# EAGLE design heehaw10 (EAGLE 9.6.2)
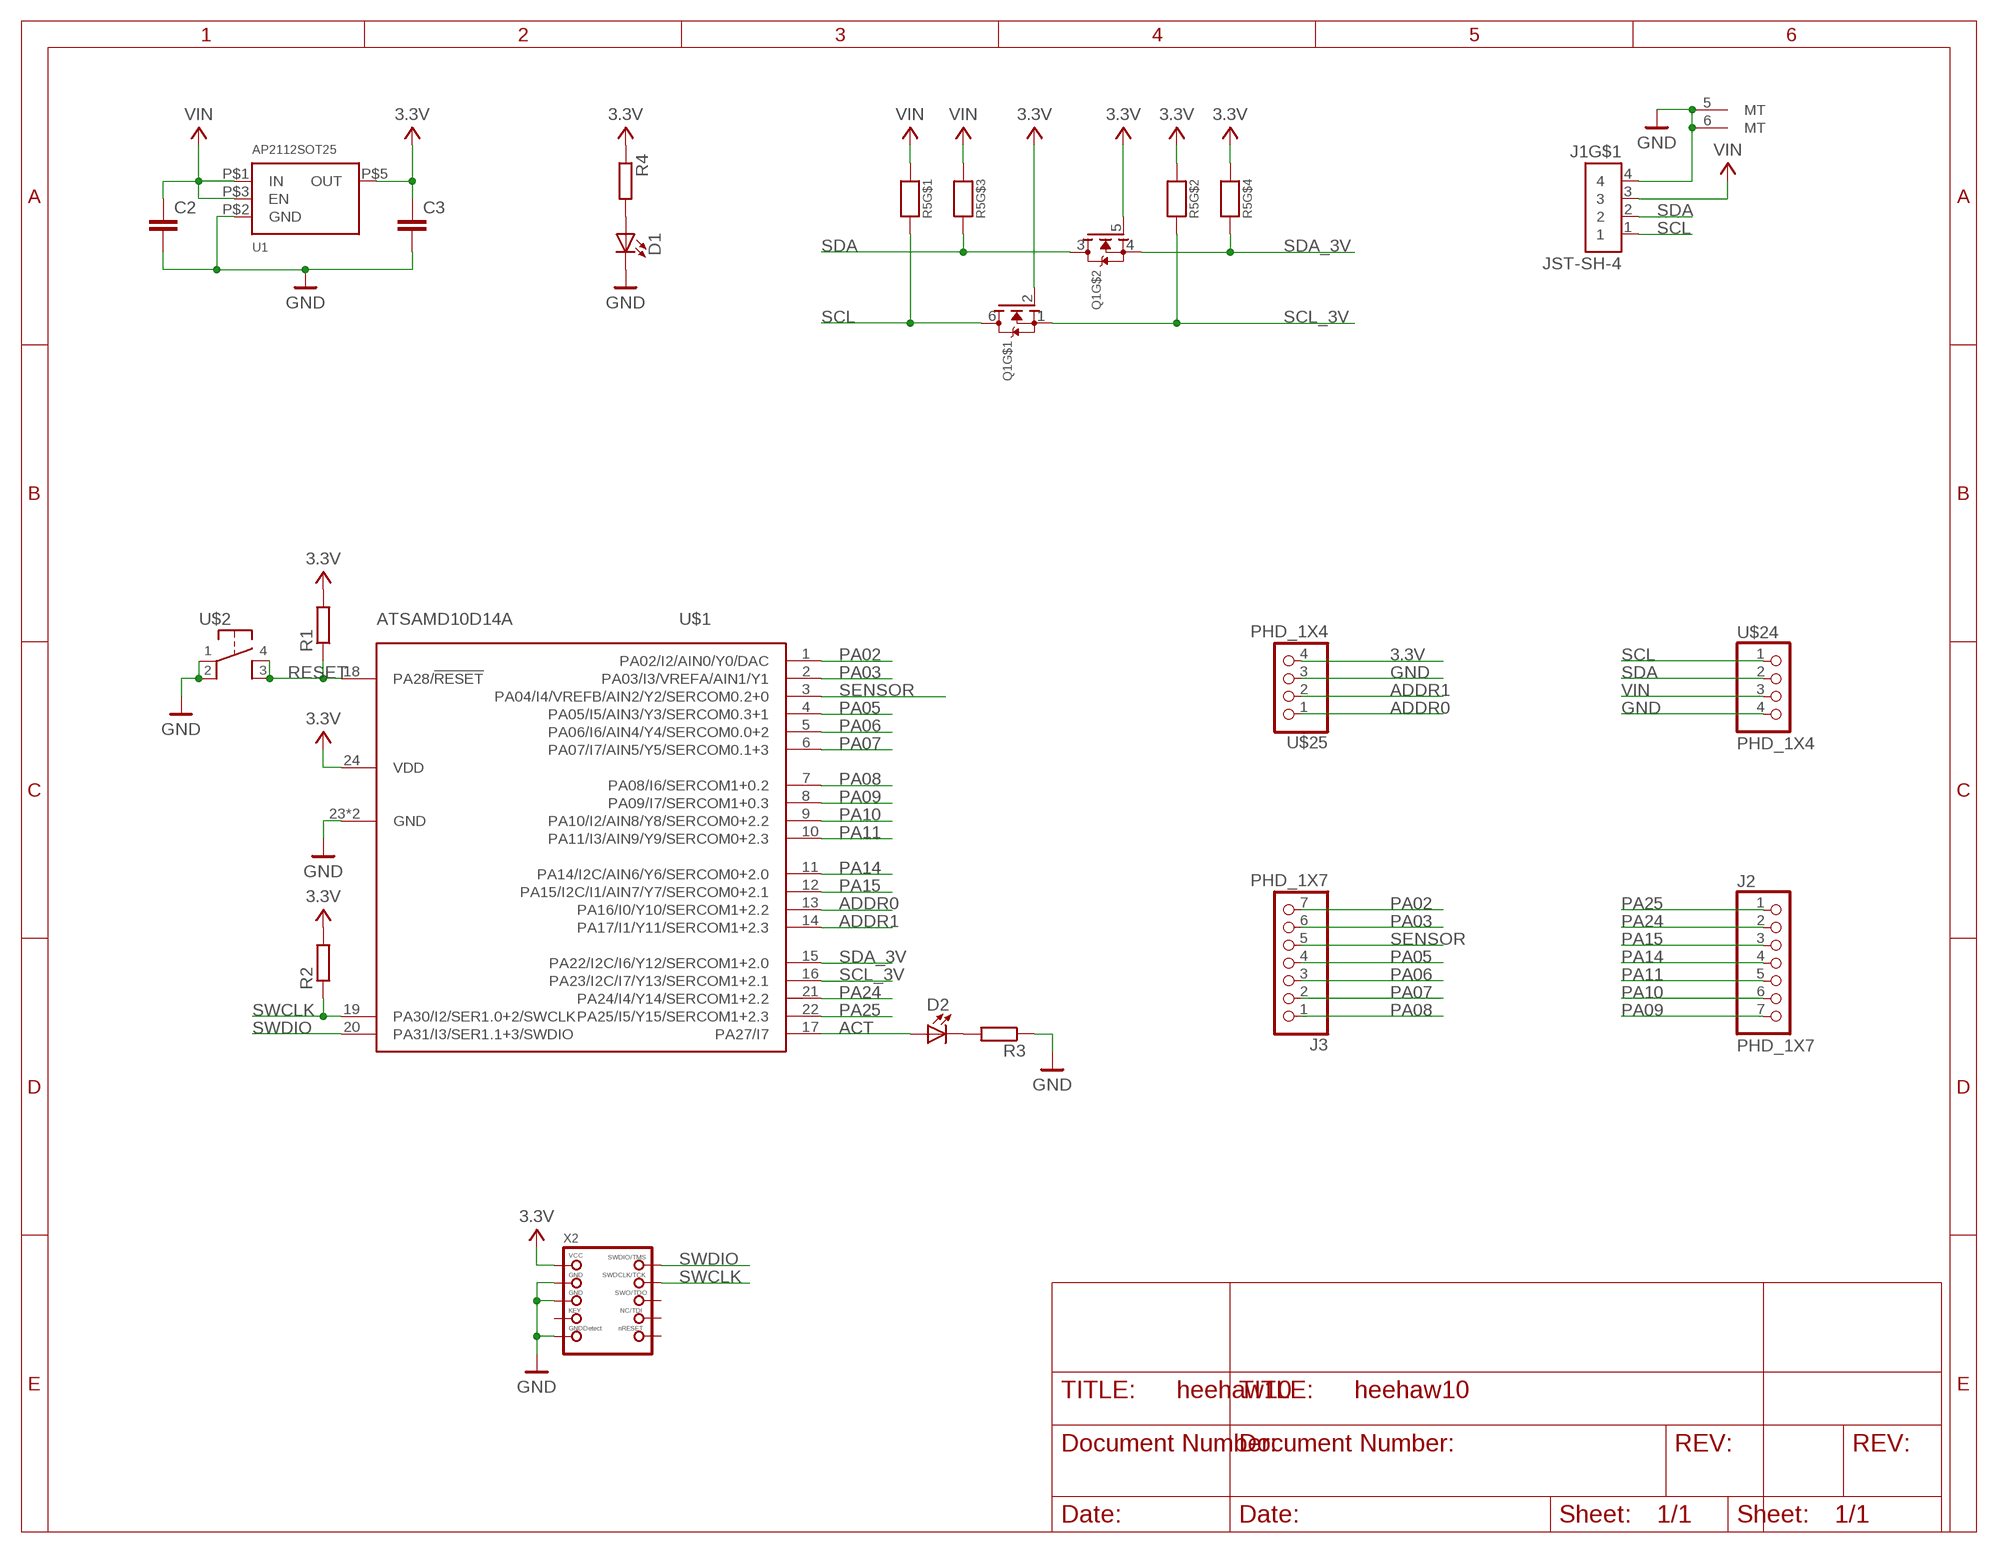
[diagram p0: schematic, sheet 1]

## Parts
C2  C-EUC0603  [C0603]
C3  C-EUC0603  [C0603]
D1  SMD_LED0603  [LED0603]
D2  SMD_LED0603  [LED0603]
J1  JST-SH-4  [JST-S4B-SH-SM4-TB]
J2  PHD_1X7  [PHD_1X7]
J3  PHD_1X7  [PHD_1X7]
Q1  MOSFET-N_DUAL  [SOT363]
R1  R-EU_R0603  [R0603]
R2  R-EU_R0603  [R0603]
R3  R-EU_R0603  [R0603]
R4  R-EU_R0603  [R0603]
R5  RESISTOR_4PACK  [RESPACK_4X0603]
U1  AP2112SOT25  [SOT25]
U$1  ATSAMD10D14A  [QFN24_4MM]
U$2  PTS647  [PTS647]
U$24  PHD_1X4  [PHD_1X4]
U$25  PHD_1X4  [PHD_1X4]
X2  SWD_2X5  [SWD_MINI]

## Nets
3.3V: C3.1 Q1.2(G) Q1.5(G) R1.2 R2.2 R4.1 R5.2 R5.4 U1.P$5(OUT) U$1.24(VDD) U$25.4 X2.1(VCC)
ACT: D2.2(A) U$1.17(PA27/I7)
ADDR0: U$1.13(PA16/I0/Y10/SERCOM1+2.2) U$25.1
ADDR1: U$1.14(PA17/I1/Y11/SERCOM1+2.3) U$25.2
GND: C2.2 C3.2 D1.1(C) J1.4 J1.5(MT) J1.6(MT) R3.1 U1.P$2(GND) U$1.23(GND) U$1.THERM(GND) U$2.1 U$2.2 U$24.4 U$25.3 X2.3(GND) X2.5(GND) X2.9(GNDDETECT)
N$2: D1.2(A) R4.2
N$3: D2.1(C) R3.2
PA02: J3.7 U$1.1(PA02/I2/AIN0/Y0/DAC)
PA03: J3.6 U$1.2(PA03/I3/VREFA/AIN1/Y1)
PA05: J3.4 U$1.4(PA05/I5/AIN3/Y3/SERCOM0.3+1)
PA06: J3.3 U$1.5(PA06/I6/AIN4/Y4/SERCOM0.0+2)
PA07: J3.2 U$1.6(PA07/I7/AIN5/Y5/SERCOM0.1+3)
PA08: J3.1 U$1.7(PA08/I6/SERCOM1+0.2)
PA09: J2.7 U$1.8(PA09/I7/SERCOM1+0.3)
PA10: J2.6 U$1.9(PA10/I2/AIN8/Y8/SERCOM0+2.2)
PA11: J2.5 U$1.10(PA11/I3/AIN9/Y9/SERCOM0+2.3)
PA14: J2.4 U$1.11(PA14/I2C/AIN6/Y6/SERCOM0+2.0)
PA15: J2.3 U$1.12(PA15/I2C/I1/AIN7/Y7/SERCOM0+2.1)
PA24: J2.2 U$1.21(PA24/I4/Y14/SERCOM1+2.2)
PA25: J2.1 U$1.22(PA25/I5/Y15/SERCOM1+2.3)
RESET: R1.1 U$1.18(PA28/!RESET) U$2.3 U$2.4
SCL: J1.1 Q1.6(D) R5.8 U$24.1
SCL_3V: Q1.1(S) R5.7 U$1.16(PA23/I2C/I7/Y13/SERCOM1+2.1)
SDA: J1.2 Q1.3(D) R5.6 U$24.2
SDA_3V: Q1.4(S) R5.5 U$1.15(PA22/I2C/I6/Y12/SERCOM1+2.0)
SENSOR: J3.5 U$1.3(PA04/I4/VREFB/AIN2/Y2/SERCOM0.2+0)
SWCLK: R2.1 U$1.19(PA30/I2/SER1.0+2/SWCLK) X2.4(SWDCLK)
SWDIO: U$1.20(PA31/I3/SER1.1+3/SWDIO) X2.2(SWDIO)
VIN: C2.1 J1.3 R5.1 R5.3 U1.P$1(IN) U1.P$3(EN) U$24.3
Unconnected: X2.6(SWO) X2.7(KEY) X2.8(TDI) X2.10(NRESET)

## Library data of the parts
C2 C3 = rcl:C-EU: CAPACITOR, European symbol; SPICEPREFIX: C
D1 D2 = Ooo-LED:SMD_LED
J1 = Ooo-Connectors:JST-SH-4
J2 J3 = Ooo-Connectors:PHD_1X7
Q1 = Ooo-Transistors:MOSFET-N_DUAL: Dual N-Channel MOSFET SOT363 (2.0x1.25mm) 2N7002PS - 60V, 320mA [Digikey: 568-5984-1-ND]
R1-R4 = rcl:R-EU_: RESISTOR, European symbol; SPICEPREFIX: R
R5 = Ooo-Resistors:RESISTOR_4PACK: Resistor Packs (4 resistors) 4 x 0603 10K 1/16W - Digikey: YC164J-10KCT-ND
U1 = Ooo-IC-Power:AP2112
U$1 = Ooo-IC-Microcontroller:ATSAMD10D14A
U$2 = Ooo-Switches:PTS647: C&K PTS647 Tact Switch
U$24 U$25 = Ooo-Connectors:PHD_1X4
X2 = Ooo-Connectors:SWD_2X5: SWD Connector Standard 0.05" 10-pin connector.

## Board
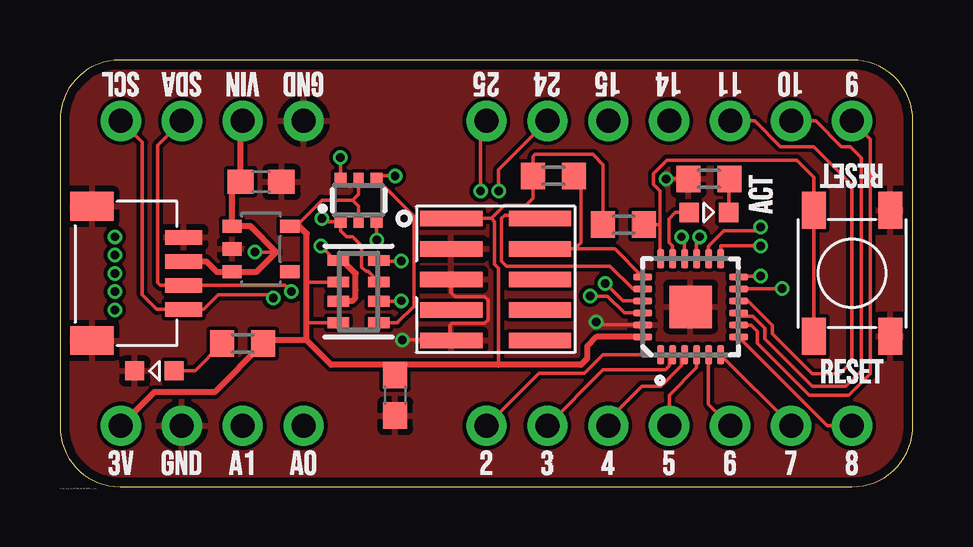
[diagram p1: board, top side]
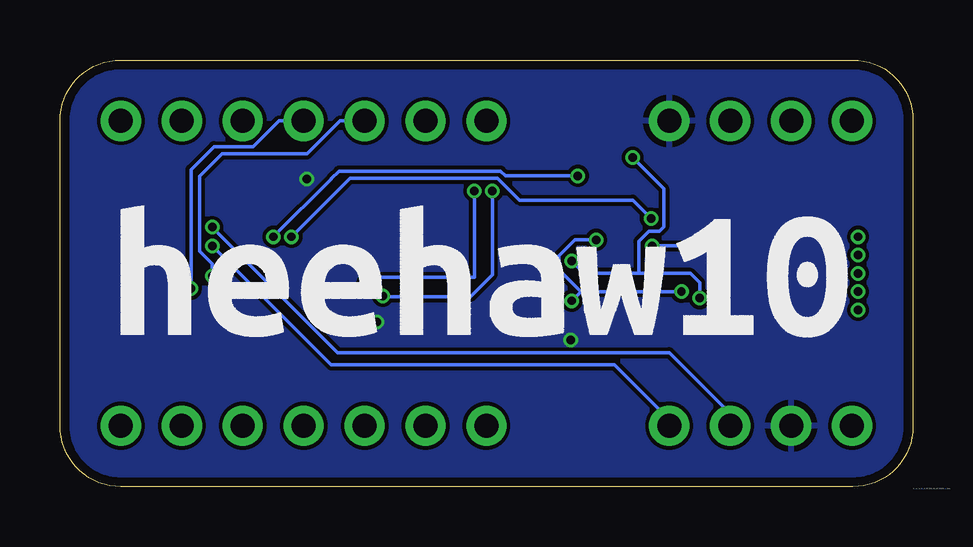
[diagram p2: board, bottom side, seen from below]

Size 35.56 x 17.78 mm. Coordinates in mm from the lower left corner, seen from the top.
Outline: 0,15.28 0,2.5 arc90 2.5,0 33.02,0 arc90 35.56,2.54 35.56,15.24 arc90 33.02,17.78 2.5,17.78 arc90 0,15.28
Copper layers (1*16): Top 0.035559375mm / dielectric 1.6mm / Bottom 0.035559375mm
Design rules "oshpark-2layer": minimum track width 6mil, minimum drill 10mil, track to track 6mil, track to pad 6mil, pad to pad 6mil, via to via 6mil, smd to smd 6mil, copper to edge 15mil, drill to drill 6mil, minimum pad ring 5mil, minimum via ring 5mil, stop-mask expansion 2.5mil, vias tented up to drill 0mil, thermal gap 10mil

### Footprints (pad centres in the part's own frame; a part is rotated, then mirrored left to right if it is on the bottom)
C0603 = smd 1.1 x 1: 1 -0.85,0; 2 0.85,0
LED0603 = smd 0.8 x 0.8: 1 -0.825,0; 2 0.825,0
JST-S4B-SH-SM4-TB = smd 1.55 x 0.6: 1 -4.525,1.5; 2 -4.525,0.5; 3 -4.525,-0.5; 4 -4.525,-1.5 | smd 1.8 x 1.2: 5 -0.7,2.8; 6 -0.7,-2.8
PHD_1X7 = drill 1 pad 1.676: 1 0,0; 2 2.54,0; 3 5.08,0; 4 7.62,0; 5 10.16,0; 6 12.7,0; 7 15.24,0
SOT363 = smd 0.5 x 0.5: 1 -0.75,-0.9; 3 0.75,-0.9; 4 0.75,0.9; 6 -0.75,0.9 | smd 0.4 x 0.5: 2 0,-0.9; 5 0,0.9
R0603 = smd 1 x 1.1: 1 -0.85,0; 2 0.85,0
RESPACK_4X0603 = smd 0.45 x 0.9: 1 -1.3,-0.85; 2 -0.4,-0.85; 3 0.4,-0.85; 4 1.3,-0.85; 5 1.3,0.85; 6 0.4,0.85; 7 -0.4,0.85; 8 -1.3,0.85
SOT25 = smd 0.55 x 0.8: P$1 0.95,1.2; P$2 0,1.2; P$3 -0.95,1.2; P$4 -0.95,-1.2; P$5 0.95,-1.2
QFN24_4MM = smd 0.8 x 0.28: 1 -2,1.25; 2 -2,0.75; 3 -2,0.25; 4 -2,-0.25; 5 -2,-0.75; 6 -2,-1.25; 13 2,-1.25; 14 2,-0.75; 15 2,-0.25; 16 2,0.25; 17 2,0.75; 18 2,1.25 | smd 0.28 x 0.8: 7 -1.25,-2; 8 -0.75,-2; 9 -0.25,-2; 10 0.25,-2; 11 0.75,-2; 12 1.25,-2; 19 1.25,2; 20 0.75,2; 21 0.25,2; 22 -0.25,2; 23 -0.75,2; 24 -1.25,2 | smd 1.778 x 1.778: THERM 0,0
PTS647 = smd 1.55 x 1: 1 -2.625,1.6; 2 2.625,1.6; 3 -2.625,-1.6; 4 2.625,-1.6
PHD_1X4 = drill 1 pad 1.676: 1 0,0; 2 2.54,0; 3 5.08,0; 4 7.62,0
SWD_MINI = smd 0.65 x 2.6: 1 -2.54,-1.85; 2 -2.54,1.85; 3 -1.27,-1.85; 4 -1.27,1.85; 5 0,-1.85; 6 0,1.85; 7 1.27,-1.85; 8 1.27,1.85; 9 2.54,-1.85; 10 2.54,1.85

### Placement (x,y rotation side)
C2  8.38,12.7 0 top
C3  13.97,3.81 270 top
D1  3.94,4.83 0 top
D2  27.05,11.43 180 top
J1  0.64,8.89 180 top
J2  17.78,15.24 0 top
J3  33.02,2.54 180 top
Q1  12.45,11.94 0 top
R1  23.5,10.92 180 top
R2  20.57,12.95 180 top
R3  27.05,12.83 0 top
R4  7.62,5.97 180 top
R5  12.45,8.13 270 top
U1  8.38,9.91 90 top
U$1  26.29,7.49 90 top
U$2  33.02,8.89 270 top
U$24  2.54,15.24 0 top
U$25  10.16,2.54 180 top
X2  18.16,8.64 270 top

### Tracks (layer width: path | path; a pad name or v marks a point on that pad's centre or on a via)
3.3V
  Top 0.152: R5.2 10.31,8.53 10.29,8.51 | R5.4 10.32,6.83 10.29,6.86 | C3.1 13.97,5.08 | 9.84,10.86 10.92,11.94 12.19,11.94 | 12.19,11.94 12.45,11.68 Q1.2 | Q1.5 12.45,12.19 12.19,11.94 | X2.1 17.98,11.18 | 17.98,11.18 18.54,11.73 19.43,11.73 19.72,12.02 R2.2 19.72,13.76 19.81,13.84 22.23,13.84 22.64,13.42 R1.2 | 17.98,11.18 18.11,11.05 18.11,9.27 18.29,9.09 18.29,5.08 | U1.P$5 9.97,10.86
  Top 0.254: U$1.24 22.37,6.24 21.97,5.84 21.97,5.33 21.72,5.08 18.29,5.08 13.97,5.08 11.3,5.08 10.29,6.1 | 10.29,6.1 10.29,6.86 10.29,8.51 10.29,10.54 9.97,10.86 | U1.P$5 9.84,10.86 | 10.29,6.1 8.6,6.1 R4.1 6.44,3.94 3.94,3.94 U$25.4
ACT
  Top 0.152: U$1.17 25.54,10.03 25.38,10.19 25.38,11.15 25.65,11.43 D2.2
ADDR0  (via drill 0.35)
  Top 0.152: U$1.13 27.56,9.51 27.56,10.03 v29.21,10.03
  Bottom 0.152: v29.21,10.03 24.26,5.08 12.45,5.08 10.16,2.79 U$25.1
ADDR1  (via drill 0.35)
  Top 0.152: U$1.14 27.04,10.02 27.69,10.67 29.06,10.67 v29.21,10.82
  Bottom 0.152: v29.21,10.82 23.98,5.59 10.16,5.59 7.62,3.05 U$25.2
GND  (via drill 0.35)
  Top 0.152: X2.9 16.29,6.12 | 16.29,6.12 v14.28,6.12 | U$1.23 22.47,6.74 v22.35,6.86 | X2.5 16.31,8.07 16.46,7.92 17.71,7.92 17.84,7.79 17.84,6.95 17.71,6.81 16.34,6.81 16.26,6.73 16.26,6.15 16.29,6.12 | R3.1 v25.27,12.83
  pour Top: 0,0 0,17.78 35.56,17.78 35.56,0
  pour Bottom: 0,0 0,17.78 35.56,17.78 35.56,0
N$1  (via drill 0.35)
  other vias: 2.29,10.41
N$2
  Top 0.152: R4.2 5.63,4.83 D1.2
N$3
  Top 0.152: D2.1 27.88,12.8 R3.2
N$4  (via drill 0.35)
  other vias: 2.29,9.65
N$5  (via drill 0.35)
  other vias: 2.29,8.89
N$6  (via drill 0.35)
  other vias: 2.29,8.13
N$7  (via drill 0.35)
  other vias: 2.29,7.37
PA02
  Top 0.152: J3.7 19.96,4.72 21.86,4.72 22.63,5.49 U$1.1
PA03
  Top 0.152: U$1.2 25.41,5.36 25.41,5.04 25.23,4.86 22.64,4.86 J3.6
PA05
  Top 0.152: U$1.4 26.54,4.95 25.4,3.81 J3.4
PA06
  Top 0.152: U$1.5 27.04,3.44 J3.3
PA07
  Top 0.152: U$1.6 30.48,2.55 J3.2
PA08
  Top 0.152: U$1.7 31.99,2.54 J3.1
PA09
  Top 0.152: U$1.8 28.83,6.73 29.08,6.48 29.08,5.97 31.24,3.81 32.89,3.81 33.78,4.7 33.78,14.48 J2.7
PA10
  Top 0.152: U$1.9 28.42,7.11 28.88,7.11 29.39,6.6 29.39,6.17 31.37,4.19 32.77,4.19 33.4,4.83 33.4,13.72 32.94,14.17 32.58,14.17 31.51,15.24 J2.6
PA11
  Top 0.152: U$1.10 28.68,7.74 29.69,6.73 29.69,6.38 31.37,4.7 32.51,4.7 33.02,5.21 33.02,12.57 31.42,14.17 30.04,14.17 28.97,15.24 J2.5
PA14  (via drill 0.35)
  Top 0.152: U$1.11 30.09,8.24 v30.1,8.26
  Bottom 0.152: v30.1,8.26 30.1,13.21 29.13,14.17 27.5,14.17 26.43,15.24 J2.4
PA15  (via drill 0.35)
  Top 0.152: U$1.12 28.32,8.77 v29.21,8.77
  Bottom 0.152: v29.21,8.77 29.21,9.28 29.74,9.81 29.74,12.93 28.8,13.87 25.26,13.87 23.89,15.24 J2.3
PA24  (via drill 0.35)
  Top 0.152: U$1.21 23.46,7.74 v22.73,8.47 | v18.29,12.32 18.29,13.21 J2.2
  Bottom 0.152: v22.73,8.47 22.48,8.73 18.29,8.73 v18.29,12.32
PA25  (via drill 0.35)
  Top 0.152: U$1.22 23.53,7.24 22.83,7.94 v22.1,7.94 | v17.53,12.32 17.53,14.99 J2.1
  Bottom 0.152: v22.1,7.94 22.07,7.92 18.45,7.92 17.53,8.83 v17.53,12.32
RESET
  Top 0.152: 25,9.53 U$1.18 25.02,9.51 25.02,10.92 | R1.1 25.02,10.92 | U$2.4 U$2.3 31.42,12.9 30.72,13.61 25.3,13.61 24.74,13.05 24.74,12.61 25.02,12.33 25.02,10.92
SCL  (via drill 0.35)
  Top 0.152: U$24.1 3.43,14.35 3.43,8 4.04,7.39 J1.1 5.99,7.39 6.6,8 8.75,8 v8.89,7.86 | v14.22,9.4 13.33,9.4 R5.8 | v11.68,13.72 11.7,13.7 Q1.6
  Bottom 0.152: v8.89,7.86 8.89,8.51 9.27,8.89 11.43,8.89 | 11.43,8.89 13.72,8.89 v14.22,9.4 | 11.43,8.89 11.43,10.22 11.01,10.64 10.57,10.64 10.39,10.83 10.39,12.42 v11.68,13.72
SCL_3V  (via drill 0.35)
  Top 0.152: U$1.16 26.04,10.28 v25.91,10.41 | R5.7 12.85,8.97 12.75,8.97 12.57,9.15 12.57,10.03 12.19,10.41 11.94,10.41 11.7,10.66 Q1.1 11.06,11.04 v10.92,11.18
  Bottom 0.152: v10.92,11.18 11.68,11.94 16.4,11.94 17.31,12.85 23.47,12.85 v25.91,10.41
SDA  (via drill 0.35)
  Top 0.152: U$24.2 4.06,14.22 4.06,8.51 4.18,8.39 J1.2 9.39,8.39 v9.65,8.13 | v14.22,7.75 14.21,7.73 R5.6 | v13.21,10.29 13.2,10.3 Q1.3
  Bottom 0.152: v9.65,8.13 13.84,8.13 | 13.84,8.13 v14.22,7.75 | 13.84,8.13 14.76,9.04 14.76,9.62 14.09,10.29 v13.21,10.29
SDA_3V  (via drill 0.35)
  Top 0.152: U$1.15 26.54,10.29 v26.66,10.41 | R5.5 14.07,6.83 14.1,6.86 14.1,6.87 14.76,7.53 14.76,11.28 Q1.4 13.31,12.95 v13.97,12.95
  Bottom 0.152: v26.66,10.41 24.26,12.82 24.26,12.83 23.93,13.15 17.19,13.15 16.98,12.95 v13.97,12.95
SENSOR
  Top 0.152: U$1.3 25.91,5.36 25.91,5.04 25.06,4.19 24.26,4.19 22.86,2.79 J3.5
SWCLK
  Top 0.152: U$1.19 23.13,9.91 21.46,9.91 | X2.4 21.21,9.91 21.46,9.91 | R2.1 21.72,12.66 21.72,10.16 21.46,9.91
SWDIO
  Top 0.152: U$1.20 23.88,8.24 22.93,9.19 18.62,9.19 18.41,9.4 18.41,11.18 18.54,11.3 19.88,11.3 X2.2
VIN  (via drill 0.35)
  Top 0.152: 11.57,9.4 R5.1 11.47,9.43 v10.87,10.03 | v8.13,9.78 9.02,9.78
  Top 0.254: J1.3 6.1,9.39 6.54,8.96 U1.P$3 8.19,8.96 9.02,9.78 7.94,10.86 U1.P$1 7.18,12.35 C2.1 7.53,15.15 U$24.3 | R5.3 11.62,7.75 12.19,7.75 12.32,7.87 12.32,8.18 12.32,8.19 12.32,8.88 11.81,9.4 11.57,9.4
  Bottom 0.152: v10.87,10.03 8.38,10.03 v8.13,9.78

### Text on the board
tPlace: /home/methuzla/PCB/HeeHaw-PCB/tPlace.bmp
bPlace: /home/methuzla/PCB/HeeHaw-PCB/bPlace.bmp